# Altium schematic sheet conn_usbc.SchDoc
size A; SheetNumber: 12
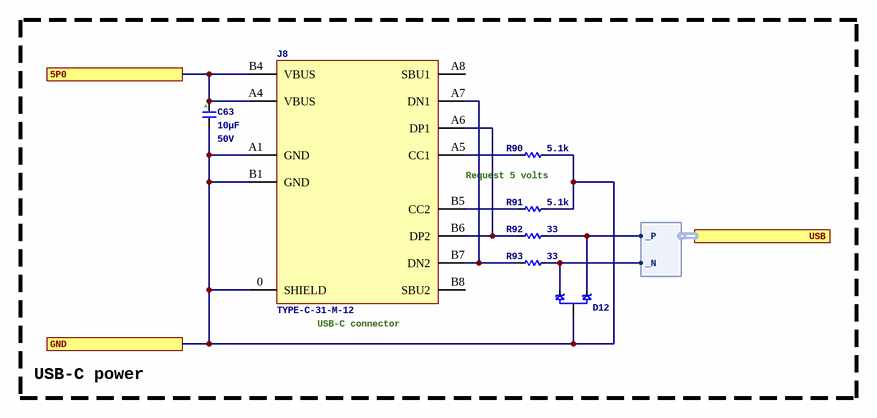
[diagram p0: conn_usbc.SchDoc]

## Parts
C63  Capacitance: 10µF  Voltage - Rated: 50V  [C1206_1.90MM]  (hidden comment: CGA5L1X7R1H106K160AC)
D12  PESD2USB3UX  [3SOT23]  (value not drawn)
J8  TYPE-C-31-M-12  [CONN_USBC_TYPE-C-31-M-12]
R90  Resistance: 5.1k  [R0402_0.40MM]  (hidden comment: ERJ-2RKF5101X)
R91  Resistance: 5.1k  [R0402_0.40MM]  (hidden comment: ERJ-2RKF5101X)
R92  Resistance: 33  [R0402_0.40MM]  (hidden comment: ERJ-2RKF33R0X)
R93  Resistance: 33  [R0402_0.40MM]  (hidden comment: ERJ-2RKF33R0X)

## Ports
5P0, GND, USB (harness DIFF)

## Harnesses
DIFF: _P, _N

## Nets
5P0: C63.1 J8.A4(VBUS) J8.B4(VBUS) ; port 5P0
GND: C63.2 D12.3 J8.0(SHIELD) J8.A1(GND) J8.B1(GND) R90.1 R91.1 ; port GND
NetD12_1: D12.1 R92.1 ; port USB._P
NetD12_2: D12.2 R93.1 ; port USB._N
NetJ8_A5: J8.A5(CC1) R90.2
NetJ8_A6: J8.A6(DP1) J8.B6(DP2) R92.2
NetJ8_A7: J8.A7(DN1) J8.B7(DN2) R93.2
NetJ8_B5: J8.B5(CC2) R91.2

Not connected (* = marked no-connect by the designer): J8 A8(SBU1) B8(SBU2)

## Notes on the sheet
- Request 5 volts
- (near J8) USB-C connector
- USB-C power
- (in symbol CGA5L1X7R1H106K160AC) A

## Library data of the parts
C63 = CGA5L1X7R1H106K160AC: CAP CER 10UF 50V X7R 1206; Manufacturer: TDK Corporation; Unit Price (USD): 1.03; Tolerance: ±10%; ComponentLink1URL: https://product.tdk.com/info/en/catalog/datasheets/mlcc_automotive_general_en.pdf?ref_disty=digikey; ComponentLink1Description: Series Datasheet; Series: CGA; Part Status: Active; Temperature Coefficient: X7R; Operating Temperature: -55°C ~ 125°C; Applications: AEC-Q200; Mounting Type: Surface Mount, MLCC; Package / Case: 1206 (3216 Metric); Size / Dimension: 0.126" L x 0.063" W (3.20mm x 1.60mm); Thickness (Max): 0.075" (1.90mm); Supplier 1: Digikey; Supplier Part Number 1: 445-180362-1-ND; Manufacturer Part Number: CGA5L1X7R1H106K160AC
D12 = TVS_PESD2USB3UX-T: DIODE ESD USB SOT-23; Manufacturer: Nexperia USA Inc.; Supplier 1: Digikey; Supplier Part Number 1: 1727-PESD2USB3UX-CT-ND; Manufacturer Part Number: PESD2USB3UX; Supplier 2: LCSC; Supplier Part Number 2: C3708426; ComponentLink1Description: Datasheet; ComponentLink1URL: https://assets.nexperia.com/documents/data-sheet/PESD2USB3UX-T.pdf
J8 = CONN_USBC_TYPE-C-31-M-12: 5A 1 16P Female Type-C SMD USB Connectors ROHS; Manufacturer: HRO Electronics; ComponentLink1Description: Product page; ComponentLink1URL: https://en.krhro.com/Product-Details/726.html; ComponentLink2Description: Drawing; ComponentLink2URL: https://omo-oss-file.thefastfile.com/portal-saas/new2023011311465142457/cms/file/95f41c83-14fa-41cb-9f86-8d6a717317e5.pdf; Supplier 1: LCSC; Supplier Part Number 1: C165948; Manufacturer Part Number: TYPE-C-31-M-12
R90 R91 = ERJ-2RKF5101X: RES SMD 5.1K OHM 1% 1/10W 0402; Manufacturer: Panasonic Electronic Components; Unit Price (USD): 0.1; Power (Watts): 0.1W, 1/10W; Temperature Coefficient: ±100ppm/°C; ComponentLink1Description: Datasheet; ComponentLink1URL: https://industrial.panasonic.com/cdbs/www-data/pdf/RDA0000/AOA0000C304.pdf; Series: ERJ; Tolerance: ±1%; Composition: Thick Film; Features: Automotive AEC-Q200; Operating Temperature: -55°C ~ 155°C; Package / Case: 0402 (1005 Metric); Supplier Device Package: 0402; Size / Dimension: 0.039" L x 0.020" W (1.00mm x 0.50mm); Height - Seated (Max): 0.016" (0.40mm); Supplier 1: Digikey; Supplier Part Number 1: P5.10KLCT-ND; Manufacturer Part Number: ERJ-2RKF5101X
R92 R93 = ERJ-2RKF33R0X: RES SMD 33 OHM 1% 1/10W 0402; Manufacturer: Panasonic Electronic Components; Unit Price (USD): 0.1; Power (Watts): 0.1W, 1/10W; Temperature Coefficient: ±100ppm/°C; ComponentLink1Description: Datasheet; ComponentLink1URL: https://industrial.panasonic.com/cdbs/www-data/pdf/RDA0000/AOA0000C304.pdf; Series: ERJ; Tolerance: ±1%; Composition: Thick Film; Features: Automotive AEC-Q200; Operating Temperature: -55°C ~ 155°C; Package / Case: 0402 (1005 Metric); Supplier Device Package: 0402; Size / Dimension: 0.039" L x 0.020" W (1.00mm x 0.50mm); Height - Seated (Max): 0.016" (0.40mm); Supplier 1: Digikey; Supplier Part Number 1: P33.0LCT-ND; Manufacturer Part Number: ERJ-2RKF33R0X